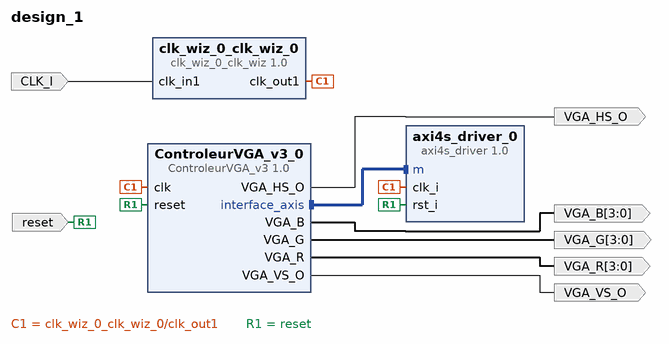
[diagram p0: block diagram of the top level]
# Vivado block design design_1, xc7z007sclg400-1, Vivado 2020.2
create_bd_design design_1

create_bd_port -dir O VGA_VS_O
create_bd_port -dir O -from 3 -to 0 VGA_B
create_bd_port -dir O VGA_HS_O
create_bd_port -dir O -from 3 -to 0 VGA_R
create_bd_port -dir O -from 3 -to 0 VGA_G
create_bd_port -dir I -type rst reset
set_property -dict {CONFIG.POLARITY ACTIVE_HIGH} [get_bd_ports reset]
create_bd_port -dir I CLK_I

create_bd_cell -type ip -vlnv user.org:user:clk_wiz_0_clk_wiz:1.0 clk_wiz_0_clk_wiz_0
create_bd_cell -type ip -vlnv user.org:user:axi4s_driver:1.0 axi4s_driver_0
set_property -dict [list \
  CONFIG.G_DATA_WIDTH 24 \
  CONFIG.G_FILE_PATH /home/glen/Documents/AJC-Expleo/Travaux/Projet_CronerDetection/Exemples/Reference_design_project_2020.2__720__0/Reference_design_project_2020.2/src/sim/sample_in_gray_crop.txt \
] [get_bd_cells axi4s_driver_0]
create_bd_cell -type ip -vlnv user.org:user:ControleurVGA_v3:1.0 ControleurVGA_v3_0

# ---- connections ----

connect_bd_intf_net [get_bd_intf_pins ControleurVGA_v3_0/interface_axis] [get_bd_intf_pins axi4s_driver_0/m]
connect_bd_net [get_bd_pins clk_wiz_0_clk_wiz_0/clk_out1] [get_bd_pins axi4s_driver_0/clk_i] [get_bd_pins ControleurVGA_v3_0/clk]
connect_bd_net -net clk_in1_0_1 [get_bd_ports CLK_I] [get_bd_pins clk_wiz_0_clk_wiz_0/clk_in1]
connect_bd_net [get_bd_pins ControleurVGA_v3_0/VGA_HS_O] [get_bd_ports VGA_HS_O]
connect_bd_net [get_bd_pins ControleurVGA_v3_0/VGA_VS_O] [get_bd_ports VGA_VS_O]
connect_bd_net [get_bd_pins ControleurVGA_v3_0/VGA_R] [get_bd_ports VGA_R]
connect_bd_net [get_bd_pins ControleurVGA_v3_0/VGA_B] [get_bd_ports VGA_B]
connect_bd_net [get_bd_pins ControleurVGA_v3_0/VGA_G] [get_bd_ports VGA_G]
connect_bd_net [get_bd_ports reset] [get_bd_pins ControleurVGA_v3_0/reset] [get_bd_pins axi4s_driver_0/rst_i]

validate_bd_design
save_bd_design
